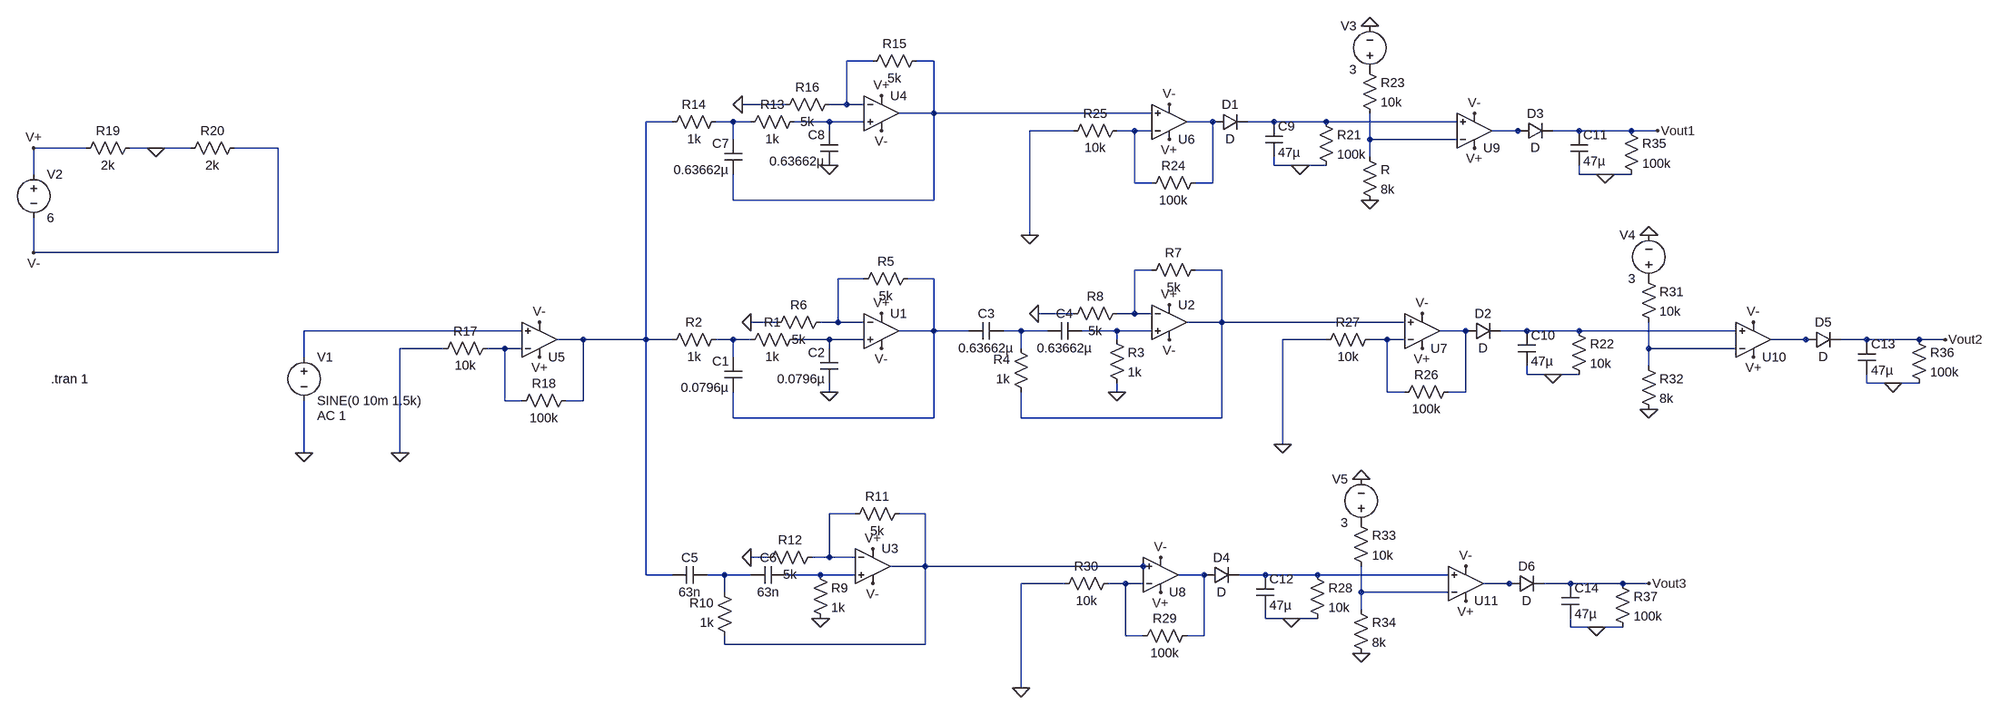
[diagram p0: schematic Schematic.asc]
Schematic.asc, the LTspice schematic file:
Version 4.1
SHEET 1 2172 1000
WIRE 16 -368 -32 -368
WIRE 128 -368 96 -368
WIRE -144 -288 -224 -288
WIRE -32 -288 -32 -368
WIRE -32 -288 -64 -288
WIRE 0 -288 -32 -288
WIRE 128 -272 128 -368
WIRE 128 -272 64 -272
WIRE 528 -272 128 -272
WIRE -352 -256 -400 -256
WIRE -240 -256 -272 -256
WIRE -208 -256 -240 -256
WIRE -64 -256 -128 -256
WIRE 0 -256 -64 -256
WIRE 640 -256 592 -256
WIRE 752 -256 704 -256
WIRE 848 -256 752 -256
WIRE 1088 -256 848 -256
WIRE -64 -240 -64 -256
WIRE 384 -240 304 -240
WIRE 496 -240 464 -240
WIRE 528 -240 496 -240
WIRE 1200 -240 1152 -240
WIRE 1216 -240 1200 -240
WIRE 1312 -240 1264 -240
WIRE 1408 -240 1312 -240
WIRE 1456 -240 1408 -240
WIRE -240 -224 -240 -256
WIRE 928 -224 928 -272
WIRE 1088 -224 928 -224
WIRE -1456 -208 -1552 -208
WIRE -1328 -208 -1376 -208
WIRE -1264 -208 -1328 -208
WIRE -1104 -208 -1184 -208
WIRE 928 -192 928 -224
WIRE 752 -176 752 -192
WIRE 800 -176 752 -176
WIRE 848 -176 800 -176
WIRE -1552 -160 -1552 -208
WIRE 1312 -160 1312 -176
WIRE 1360 -160 1312 -160
WIRE 1408 -160 1360 -160
WIRE 496 -144 496 -240
WIRE 528 -144 496 -144
WIRE 640 -144 640 -256
WIRE 640 -144 608 -144
WIRE -240 -112 -240 -160
WIRE 128 -112 128 -272
WIRE 128 -112 -240 -112
WIRE 304 -48 304 -240
WIRE -1552 -16 -1552 -80
WIRE -1104 -16 -1104 -208
WIRE -1104 -16 -1552 -16
WIRE 528 16 496 16
WIRE 656 16 608 16
WIRE 0 32 -48 32
WIRE 128 32 80 32
WIRE 384 96 320 96
WIRE 496 96 496 16
WIRE 496 96 464 96
WIRE 528 96 496 96
WIRE -160 112 -208 112
WIRE -48 112 -48 32
WIRE -48 112 -80 112
WIRE 0 112 -48 112
WIRE 656 112 656 16
WIRE 656 112 592 112
WIRE 992 112 656 112
WIRE -656 128 -1056 128
WIRE 128 128 128 32
WIRE 128 128 64 128
WIRE 192 128 128 128
WIRE 288 128 256 128
WIRE 336 128 288 128
WIRE 464 128 400 128
WIRE 528 128 464 128
WIRE 1104 128 1056 128
WIRE 1216 128 1168 128
WIRE 1312 128 1216 128
WIRE 1600 128 1312 128
WIRE -544 144 -592 144
WIRE -400 144 -400 -256
WIRE -400 144 -544 144
WIRE -352 144 -400 144
WIRE -240 144 -272 144
WIRE -208 144 -240 144
WIRE -64 144 -128 144
WIRE 0 144 -64 144
WIRE 464 144 464 128
WIRE 848 144 768 144
WIRE 960 144 928 144
WIRE 992 144 960 144
WIRE 1728 144 1664 144
WIRE 1744 144 1728 144
WIRE 1840 144 1792 144
WIRE 1936 144 1840 144
WIRE 1984 144 1936 144
WIRE -800 160 -880 160
WIRE -688 160 -720 160
WIRE -656 160 -688 160
WIRE -64 160 -64 144
WIRE 288 160 288 128
WIRE 1440 160 1440 112
WIRE 1600 160 1440 160
WIRE -1056 176 -1056 128
WIRE -240 176 -240 144
WIRE 1440 192 1440 160
WIRE 1216 208 1216 192
WIRE 1264 208 1216 208
WIRE 1312 208 1264 208
WIRE 1840 224 1840 208
WIRE 1888 224 1840 224
WIRE 1936 224 1888 224
WIRE -64 240 -64 224
WIRE 464 240 464 224
WIRE 960 240 960 144
WIRE 992 240 960 240
WIRE 1104 240 1104 128
WIRE 1104 240 1072 240
WIRE -688 256 -688 160
WIRE -656 256 -688 256
WIRE -544 256 -544 144
WIRE -544 256 -576 256
WIRE -240 288 -240 240
WIRE 128 288 128 128
WIRE 128 288 -240 288
WIRE 288 288 288 240
WIRE 656 288 656 112
WIRE 656 288 288 288
WIRE 768 336 768 144
WIRE -1056 352 -1056 256
WIRE -880 352 -880 160
WIRE -16 464 -64 464
WIRE 112 464 64 464
WIRE -176 544 -208 544
WIRE -64 544 -64 464
WIRE -64 544 -96 544
WIRE -16 544 -64 544
WIRE 112 560 112 464
WIRE 112 560 48 560
WIRE 512 560 112 560
WIRE 528 560 512 560
WIRE -400 576 -400 144
WIRE -352 576 -400 576
WIRE -256 576 -288 576
WIRE -208 576 -256 576
WIRE -80 576 -144 576
WIRE -16 576 -80 576
WIRE 624 576 576 576
WIRE 736 576 688 576
WIRE 832 576 736 576
WIRE 1072 576 832 576
WIRE 368 592 288 592
WIRE 480 592 448 592
WIRE 512 592 480 592
WIRE 1184 592 1136 592
WIRE 1200 592 1184 592
WIRE 1296 592 1248 592
WIRE 1392 592 1296 592
WIRE 1440 592 1392 592
WIRE -256 608 -256 576
WIRE 912 608 912 560
WIRE 1072 608 912 608
WIRE 912 640 912 608
WIRE 736 656 736 640
WIRE 784 656 736 656
WIRE 832 656 784 656
WIRE 1296 672 1296 656
WIRE 1344 672 1296 672
WIRE 1392 672 1344 672
WIRE 480 688 480 592
WIRE 512 688 480 688
WIRE 624 688 624 576
WIRE 624 688 592 688
WIRE -256 704 -256 688
WIRE 112 704 112 560
WIRE 112 704 -256 704
WIRE 288 784 288 592
FLAG -64 240 0
FLAG 464 240 0
FLAG -208 112 0
FLAG 320 96 0
FLAG -64 -176 0
FLAG -224 -288 0
FLAG -80 656 0
FLAG -208 544 0
FLAG -880 352 0
FLAG -1056 352 0
FLAG -1328 -208 0
FLAG -1552 -208 V+
FLAG -1552 -16 V-
FLAG -624 112 V-
FLAG 32 -240 V-
FLAG 32 160 V-
FLAG 560 144 V-
FLAG 16 592 V-
FLAG -624 176 V+
FLAG 32 -304 V+
FLAG 32 96 V+
FLAG 16 528 V+
FLAG 560 80 V+
FLAG 800 -176 0
FLAG 1264 208 0
FLAG 304 -48 0
FLAG 560 -288 V-
FLAG 560 -224 V+
FLAG 768 336 0
FLAG 1024 96 V-
FLAG 1024 160 V+
FLAG 784 656 0
FLAG 288 784 0
FLAG 544 544 V-
FLAG 544 608 V+
FLAG 928 -112 0
FLAG 1120 -208 V+
FLAG 1120 -272 V-
FLAG 928 -432 0
FLAG 1440 272 0
FLAG 1632 176 V+
FLAG 1632 112 V-
FLAG 1440 -48 0
FLAG 912 720 0
FLAG 1104 624 V+
FLAG 1104 560 V-
FLAG 912 400 0
FLAG 1360 -160 0
FLAG 1888 224 0
FLAG 1344 672 0
FLAG 1456 -240 Vout1
FLAG 1984 144 Vout2
FLAG 1440 592 Vout3
SYMBOL OpAmps\\UniversalOpAmp2 32 128 R0
SYMATTR InstName U1
SYMBOL res -112 128 R90
WINDOW 0 0 56 VBottom 2
WINDOW 3 32 56 VTop 2
SYMATTR InstName R1
SYMATTR Value 1k
SYMBOL res -256 128 R90
WINDOW 0 0 56 VBottom 2
WINDOW 3 32 56 VTop 2
SYMATTR InstName R2
SYMATTR Value 1k
SYMBOL cap -224 240 R180
WINDOW 0 24 56 Left 2
WINDOW 3 24 8 Left 2
SYMATTR InstName C1
SYMATTR Value 0.0796µ
SYMBOL cap -48 224 R180
WINDOW 0 24 56 Left 2
WINDOW 3 24 8 Left 2
SYMATTR InstName C2
SYMATTR Value 0.0796µ
SYMBOL OpAmps\\UniversalOpAmp2 560 112 R0
SYMATTR InstName U2
SYMBOL cap 256 112 R90
WINDOW 0 0 32 VBottom 2
WINDOW 3 32 32 VTop 2
SYMATTR InstName C3
SYMATTR Value 0.63662µ
SYMBOL cap 400 112 R90
WINDOW 0 0 32 VBottom 2
WINDOW 3 32 32 VTop 2
SYMATTR InstName C4
SYMATTR Value 0.63662µ
SYMBOL res 448 128 R0
SYMATTR InstName R3
SYMATTR Value 1k
SYMBOL res 304 256 R180
WINDOW 0 36 76 Left 2
WINDOW 3 36 40 Left 2
SYMATTR InstName R4
SYMATTR Value 1k
SYMBOL res 96 16 R90
WINDOW 0 0 56 VBottom 2
WINDOW 3 32 56 VTop 2
SYMATTR InstName R5
SYMATTR Value 5k
SYMBOL res -64 96 R90
WINDOW 0 0 56 VBottom 2
WINDOW 3 32 56 VTop 2
SYMATTR InstName R6
SYMATTR Value 5k
SYMBOL res 624 0 R90
WINDOW 0 0 56 VBottom 2
WINDOW 3 32 56 VTop 2
SYMATTR InstName R7
SYMATTR Value 5k
SYMBOL res 480 80 R90
WINDOW 0 0 56 VBottom 2
WINDOW 3 32 56 VTop 2
SYMATTR InstName R8
SYMATTR Value 5k
SYMBOL OpAmps\\UniversalOpAmp2 16 560 R0
SYMATTR InstName U3
SYMBOL cap -288 560 R90
WINDOW 0 0 32 VBottom 2
WINDOW 3 32 32 VTop 2
SYMATTR InstName C5
SYMATTR Value 63n
SYMBOL cap -144 560 R90
WINDOW 0 0 32 VBottom 2
WINDOW 3 32 32 VTop 2
SYMATTR InstName C6
SYMATTR Value 63n
SYMBOL res 80 448 R90
WINDOW 0 0 56 VBottom 2
WINDOW 3 32 56 VTop 2
SYMATTR InstName R11
SYMATTR Value 5k
SYMBOL OpAmps\\UniversalOpAmp2 32 -272 R0
SYMATTR InstName U4
SYMBOL res -112 -272 R90
WINDOW 0 0 56 VBottom 2
WINDOW 3 32 56 VTop 2
SYMATTR InstName R13
SYMATTR Value 1k
SYMBOL res -256 -272 R90
WINDOW 0 0 56 VBottom 2
WINDOW 3 32 56 VTop 2
SYMATTR InstName R14
SYMATTR Value 1k
SYMBOL cap -224 -160 R180
WINDOW 0 24 56 Left 2
WINDOW 3 24 8 Left 2
SYMATTR InstName C7
SYMATTR Value 0.63662µ
SYMBOL cap -48 -176 R180
WINDOW 0 24 56 Left 2
WINDOW 3 24 8 Left 2
SYMATTR InstName C8
SYMATTR Value 0.63662µ
SYMBOL res 112 -384 R90
WINDOW 0 0 56 VBottom 2
WINDOW 3 32 56 VTop 2
SYMATTR InstName R15
SYMATTR Value 5k
SYMBOL res -48 -304 R90
WINDOW 0 0 56 VBottom 2
WINDOW 3 32 56 VTop 2
SYMATTR InstName R16
SYMATTR Value 5k
SYMBOL res -240 704 R180
WINDOW 0 36 76 Left 2
WINDOW 3 36 40 Left 2
SYMATTR InstName R10
SYMATTR Value 1k
SYMBOL res -96 560 R0
SYMATTR InstName R9
SYMATTR Value 1k
SYMBOL res -80 528 R90
WINDOW 0 0 56 VBottom 2
WINDOW 3 32 56 VTop 2
SYMATTR InstName R12
SYMATTR Value 5k
SYMBOL OpAmps\\UniversalOpAmp2 -624 144 M180
SYMATTR InstName U5
SYMBOL res -560 240 R90
WINDOW 0 0 56 VBottom 2
WINDOW 3 32 56 VTop 2
SYMATTR InstName R18
SYMATTR Value 100k
SYMBOL res -704 144 R90
WINDOW 0 0 56 VBottom 2
WINDOW 3 32 56 VTop 2
SYMATTR InstName R17
SYMATTR Value 10k
SYMBOL voltage -1056 160 R0
WINDOW 123 24 124 Left 2
WINDOW 39 0 0 Left 0
SYMATTR Value2 AC 1
SYMATTR InstName V1
SYMATTR Value SINE(0 10m 1.5k)
SYMBOL voltage -1552 -176 R0
WINDOW 123 0 0 Left 0
WINDOW 39 0 0 Left 0
SYMATTR InstName V2
SYMATTR Value 6
SYMBOL res -1360 -224 R90
WINDOW 0 0 56 VBottom 2
WINDOW 3 32 56 VTop 2
SYMATTR InstName R19
SYMATTR Value 2k
SYMBOL res -1168 -224 R90
WINDOW 0 0 56 VBottom 2
WINDOW 3 32 56 VTop 2
SYMATTR InstName R20
SYMATTR Value 2k
SYMBOL diode 640 -240 R270
WINDOW 0 32 32 VTop 2
WINDOW 3 0 32 VBottom 2
SYMATTR InstName D1
SYMBOL cap 736 -256 R0
SYMATTR InstName C9
SYMATTR Value 47µ
SYMBOL res 832 -272 R0
SYMATTR InstName R21
SYMATTR Value 100k
SYMBOL diode 1104 144 R270
WINDOW 0 32 32 VTop 2
WINDOW 3 0 32 VBottom 2
SYMATTR InstName D2
SYMBOL cap 1200 128 R0
SYMATTR InstName C10
SYMATTR Value 47µ
SYMBOL res 1296 112 R0
SYMATTR InstName R22
SYMATTR Value 10k
SYMBOL OpAmps\\UniversalOpAmp2 560 -256 M180
SYMATTR InstName U6
SYMBOL res 624 -160 R90
WINDOW 0 0 56 VBottom 2
WINDOW 3 32 56 VTop 2
SYMATTR InstName R24
SYMATTR Value 100k
SYMBOL res 480 -256 R90
WINDOW 0 0 56 VBottom 2
WINDOW 3 32 56 VTop 2
SYMATTR InstName R25
SYMATTR Value 10k
SYMBOL OpAmps\\UniversalOpAmp2 1024 128 M180
SYMATTR InstName U7
SYMBOL res 1088 224 R90
WINDOW 0 0 56 VBottom 2
WINDOW 3 32 56 VTop 2
SYMATTR InstName R26
SYMATTR Value 100k
SYMBOL res 944 128 R90
WINDOW 0 0 56 VBottom 2
WINDOW 3 32 56 VTop 2
SYMATTR InstName R27
SYMATTR Value 10k
SYMBOL diode 624 592 R270
WINDOW 0 32 32 VTop 2
WINDOW 3 0 32 VBottom 2
SYMATTR InstName D4
SYMBOL cap 720 576 R0
SYMATTR InstName C12
SYMATTR Value 47µ
SYMBOL res 816 560 R0
SYMATTR InstName R28
SYMATTR Value 10k
SYMBOL OpAmps\\UniversalOpAmp2 544 576 M180
SYMATTR InstName U8
SYMBOL res 608 672 R90
WINDOW 0 0 56 VBottom 2
WINDOW 3 32 56 VTop 2
SYMATTR InstName R29
SYMATTR Value 100k
SYMBOL res 464 576 R90
WINDOW 0 0 56 VBottom 2
WINDOW 3 32 56 VTop 2
SYMATTR InstName R30
SYMATTR Value 10k
SYMBOL res 912 -368 R0
SYMATTR InstName R23
SYMATTR Value 10k
SYMBOL res 912 -208 R0
SYMATTR InstName R
SYMATTR Value 8k
SYMBOL OpAmps\\UniversalOpAmp2 1120 -240 M180
SYMATTR InstName U9
SYMBOL voltage 928 -336 R180
WINDOW 0 24 96 Left 2
WINDOW 3 24 16 Left 2
WINDOW 123 0 0 Left 0
WINDOW 39 0 0 Left 0
SYMATTR InstName V3
SYMATTR Value 3
SYMBOL res 1424 16 R0
SYMATTR InstName R31
SYMATTR Value 10k
SYMBOL res 1424 176 R0
SYMATTR InstName R32
SYMATTR Value 8k
SYMBOL OpAmps\\UniversalOpAmp2 1632 144 M180
SYMATTR InstName U10
SYMBOL voltage 1440 48 R180
WINDOW 0 24 96 Left 2
WINDOW 3 24 16 Left 2
WINDOW 123 0 0 Left 0
WINDOW 39 0 0 Left 0
SYMATTR InstName V4
SYMATTR Value 3
SYMBOL res 896 464 R0
SYMATTR InstName R33
SYMATTR Value 10k
SYMBOL res 896 624 R0
SYMATTR InstName R34
SYMATTR Value 8k
SYMBOL OpAmps\\UniversalOpAmp2 1104 592 M180
SYMATTR InstName U11
SYMBOL voltage 912 496 R180
WINDOW 0 24 96 Left 2
WINDOW 3 24 16 Left 2
WINDOW 123 0 0 Left 0
WINDOW 39 0 0 Left 0
SYMATTR InstName V5
SYMATTR Value 3
SYMBOL cap 1296 -240 R0
SYMATTR InstName C11
SYMATTR Value 47µ
SYMBOL res 1392 -256 R0
SYMATTR InstName R35
SYMATTR Value 100k
SYMBOL diode 1200 -224 R270
WINDOW 0 32 32 VTop 2
WINDOW 3 0 32 VBottom 2
SYMATTR InstName D3
SYMBOL cap 1824 144 R0
SYMATTR InstName C13
SYMATTR Value 47µ
SYMBOL res 1920 128 R0
SYMATTR InstName R36
SYMATTR Value 100k
SYMBOL diode 1728 160 R270
WINDOW 0 32 32 VTop 2
WINDOW 3 0 32 VBottom 2
SYMATTR InstName D5
SYMBOL cap 1280 592 R0
SYMATTR InstName C14
SYMATTR Value 47µ
SYMBOL res 1376 576 R0
SYMATTR InstName R37
SYMATTR Value 100k
SYMBOL diode 1184 608 R270
WINDOW 0 32 32 VTop 2
WINDOW 3 0 32 VBottom 2
SYMATTR InstName D6
TEXT -1520 216 Left 2 !.tran 1

The netlist it stands for:
* Schematic.asc
X§U1 N021 N013 V+ V- N014 level2 Avol=1Meg GBW=10Meg Slew=10Meg Ilimit=25m Rail=0 Vos=0 En=0 Enk=0 In=0 Ink=0 Rin=500Meg  ; pins In+ In- V+ V- OUT
R1 N021 N020 1k
R2 N020 N003 1k
C1 N014 N020 0.0796µ
C2 0 N021 0.0796µ
X§U2 N017 N011 V+ V- N012 level2 Avol=1Meg GBW=10Meg Slew=10Meg Ilimit=25m Rail=0 Vos=0 En=0 Enk=0 In=0 Ink=0 Rin=500Meg  ; pins In+ In- V+ V- OUT
C3 N016 N014 0.63662µ
C4 N017 N016 0.63662µ
R3 N017 0 1k
R4 N012 N016 1k
R5 N014 N013 5k
R6 N013 0 5k
R7 N012 N011 5k
R8 N011 0 5k
X§U3 N029 N026 V+ V- N027 level2 Avol=1Meg GBW=10Meg Slew=10Meg Ilimit=25m Rail=0 Vos=0 En=0 Enk=0 In=0 Ink=0 Rin=500Meg  ; pins In+ In- V+ V- OUT
C5 N028 N003 63n
C6 N029 N028 63n
R11 N027 N026 5k
X§U4 N005 N001 V+ V- N002 level2 Avol=1Meg GBW=10Meg Slew=10Meg Ilimit=25m Rail=0 Vos=0 En=0 Enk=0 In=0 Ink=0 Rin=500Meg  ; pins In+ In- V+ V- OUT
R13 N005 N004 1k
R14 N004 N003 1k
C7 N002 N004 0.63662µ
C8 0 N005 0.63662µ
R15 N002 N001 5k
R16 N001 0 5k
R10 N027 N028 1k
R9 N029 0 1k
R12 N026 0 5k
X§U5 N015 N024 V+ V- N003 level2 Avol=1Meg GBW=10Meg Slew=10Meg Ilimit=25m Rail=0 Vos=0 En=0 Enk=0 In=0 Ink=0 Rin=500Meg  ; pins In+ In- V+ V- OUT
R18 N003 N024 100k
R17 N024 0 10k
V1 N015 0 SINE(0 10m 1.5k) AC 1
V2 V+ V- 6
R19 0 V+ 2k
R20 V- 0 2k
D1 N006 N007 D
C9 N007 0 47µ
R21 N007 0 100k
D2 N018 N019 D
C10 N019 0 47µ
R22 N019 0 10k
X§U6 N002 N008 V+ V- N006 level2 Avol=1Meg GBW=10Meg Slew=10Meg Ilimit=25m Rail=0 Vos=0 En=0 Enk=0 In=0 Ink=0 Rin=500Meg  ; pins In+ In- V+ V- OUT
R24 N006 N008 100k
R25 N008 0 10k
X§U7 N012 N022 V+ V- N018 level2 Avol=1Meg GBW=10Meg Slew=10Meg Ilimit=25m Rail=0 Vos=0 En=0 Enk=0 In=0 Ink=0 Rin=500Meg  ; pins In+ In- V+ V- OUT
R26 N018 N022 100k
R27 N022 0 10k
D4 N030 N031 D
C12 N031 0 47µ
R28 N031 0 10k
X§U8 N027 N032 V+ V- N030 level2 Avol=1Meg GBW=10Meg Slew=10Meg Ilimit=25m Rail=0 Vos=0 En=0 Enk=0 In=0 Ink=0 Rin=500Meg  ; pins In+ In- V+ V- OUT
R29 N030 N032 100k
R30 N032 0 10k
R23 P001 N010 10k
R N010 0 8k
X§U9 N007 N010 V+ V- N009 level2 Avol=1Meg GBW=10Meg Slew=10Meg Ilimit=25m Rail=0 Vos=0 En=0 Enk=0 In=0 Ink=0 Rin=500Meg  ; pins In+ In- V+ V- OUT
V3 P001 0 3
R31 P002 N025 10k
R32 N025 0 8k
X§U10 N019 N025 V+ V- N023 level2 Avol=1Meg GBW=10Meg Slew=10Meg Ilimit=25m Rail=0 Vos=0 En=0 Enk=0 In=0 Ink=0 Rin=500Meg  ; pins In+ In- V+ V- OUT
V4 P002 0 3
R33 P003 N034 10k
R34 N034 0 8k
X§U11 N031 N034 V+ V- N033 level2 Avol=1Meg GBW=10Meg Slew=10Meg Ilimit=25m Rail=0 Vos=0 En=0 Enk=0 In=0 Ink=0 Rin=500Meg  ; pins In+ In- V+ V- OUT
V5 P003 0 3
C11 Vout1 0 47µ
R35 Vout1 0 100k
D3 N009 Vout1 D
C13 Vout2 0 47µ
R36 Vout2 0 100k
D5 N023 Vout2 D
C14 Vout3 0 47µ
R37 Vout3 0 100k
D6 N033 Vout3 D
.model D D
.lib standard.dio
.tran 1
.lib UniversalOpAmp2.lib
.backanno
.end